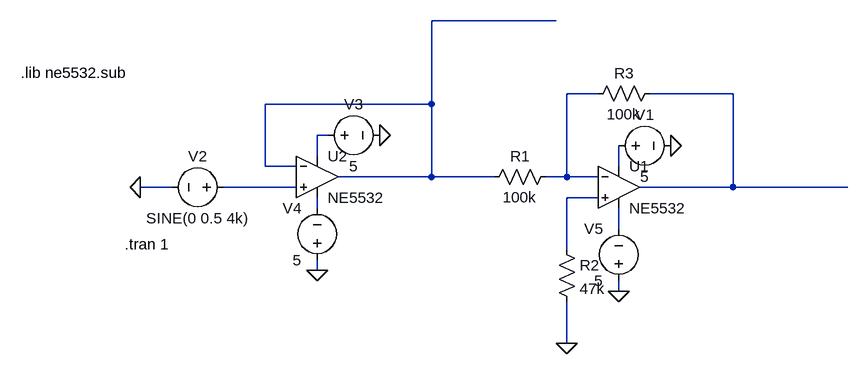
[diagram p0: schematic DiffTest.asc]
DiffTest.asc, the LTspice schematic file:
Version 4.1
SHEET 1 980 692
WIRE 368 160 176 160
WIRE 432 272 384 272
WIRE 640 272 512 272
WIRE 176 288 176 160
WIRE 176 288 -80 288
WIRE 16 336 0 336
WIRE 0 368 0 336
WIRE -80 384 -80 288
WIRE -32 384 -80 384
WIRE 464 384 464 352
WIRE 176 400 176 288
WIRE 176 400 32 400
WIRE 272 400 176 400
WIRE 384 400 384 272
WIRE 384 400 352 400
WIRE 432 400 384 400
WIRE -224 416 -272 416
WIRE -32 416 -144 416
WIRE 640 416 640 272
WIRE 640 416 496 416
WIRE 816 416 640 416
WIRE 432 432 384 432
WIRE 0 448 0 432
WIRE 464 480 464 448
WIRE 384 512 384 432
WIRE 0 544 0 528
WIRE 464 576 464 560
WIRE 384 656 384 592
FLAG -272 416 0
FLAG 384 656 0
FLAG 544 352 0
FLAG 96 336 0
FLAG 0 544 0
FLAG 464 576 0
SYMBOL voltage -128 416 R90
WINDOW 0 -32 56 VBottom 2
WINDOW 3 32 56 VTop 2
WINDOW 123 0 0 Left 0
WINDOW 39 0 0 Left 0
SYMATTR InstName V2
SYMATTR Value SINE(0 0.5 4k)
SYMBOL OpAmps\\opamp2 0 336 R0
SYMATTR InstName U2
SYMATTR Value NE5532
SYMBOL res 368 384 R90
WINDOW 0 0 56 VBottom 2
WINDOW 3 32 56 VTop 2
SYMATTR InstName R1
SYMATTR Value 100k
SYMBOL OpAmps\\opamp2 464 352 R0
SYMATTR InstName U1
SYMATTR Value NE5532
SYMBOL res 368 496 R0
SYMATTR InstName R2
SYMATTR Value 47k
SYMBOL res 528 256 R90
WINDOW 0 0 56 VBottom 2
WINDOW 3 32 56 VTop 2
SYMATTR InstName R3
SYMATTR Value 100k
SYMBOL voltage 448 352 R270
WINDOW 0 32 56 VTop 2
WINDOW 3 -32 56 VBottom 2
WINDOW 123 0 0 Left 0
WINDOW 39 0 0 Left 0
SYMATTR InstName V1
SYMATTR Value 5
SYMBOL voltage 0 336 R270
WINDOW 0 32 56 VTop 2
WINDOW 3 -32 56 VBottom 2
WINDOW 123 0 0 Left 0
WINDOW 39 0 0 Left 0
SYMATTR InstName V3
SYMATTR Value 5
SYMBOL voltage 0 544 R180
WINDOW 0 24 96 Left 2
WINDOW 3 24 16 Left 2
WINDOW 123 0 0 Left 0
WINDOW 39 0 0 Left 0
SYMATTR InstName V4
SYMATTR Value 5
SYMBOL voltage 464 576 R180
WINDOW 0 24 96 Left 2
WINDOW 3 24 16 Left 2
WINDOW 123 0 0 Left 0
WINDOW 39 0 0 Left 0
SYMATTR InstName V5
SYMATTR Value 5
TEXT -296 504 Left 2 !.tran 1
TEXT -456 240 Left 2 !.lib ne5532.sub

The netlist it stands for:
* DiffTest.asc
V2 N006 0 SINE(0 0.5 4k)
X§U2 N006 N001 N004 N008 N001 NE5532  ; pins In+ In- V+ V- OUT
R1 N002 N001 100k
X§U1 N007 N002 N005 N009 N003 NE5532  ; pins In+ In- V+ V- OUT
R2 N007 0 47k
R3 N003 N002 100k
V1 N005 0 5
V3 N004 0 5
V4 0 N008 5
V5 0 N009 5
.tran 1
.lib ne5532.sub
.backanno
.end